# Altium project AirConditioning.PrjPCB
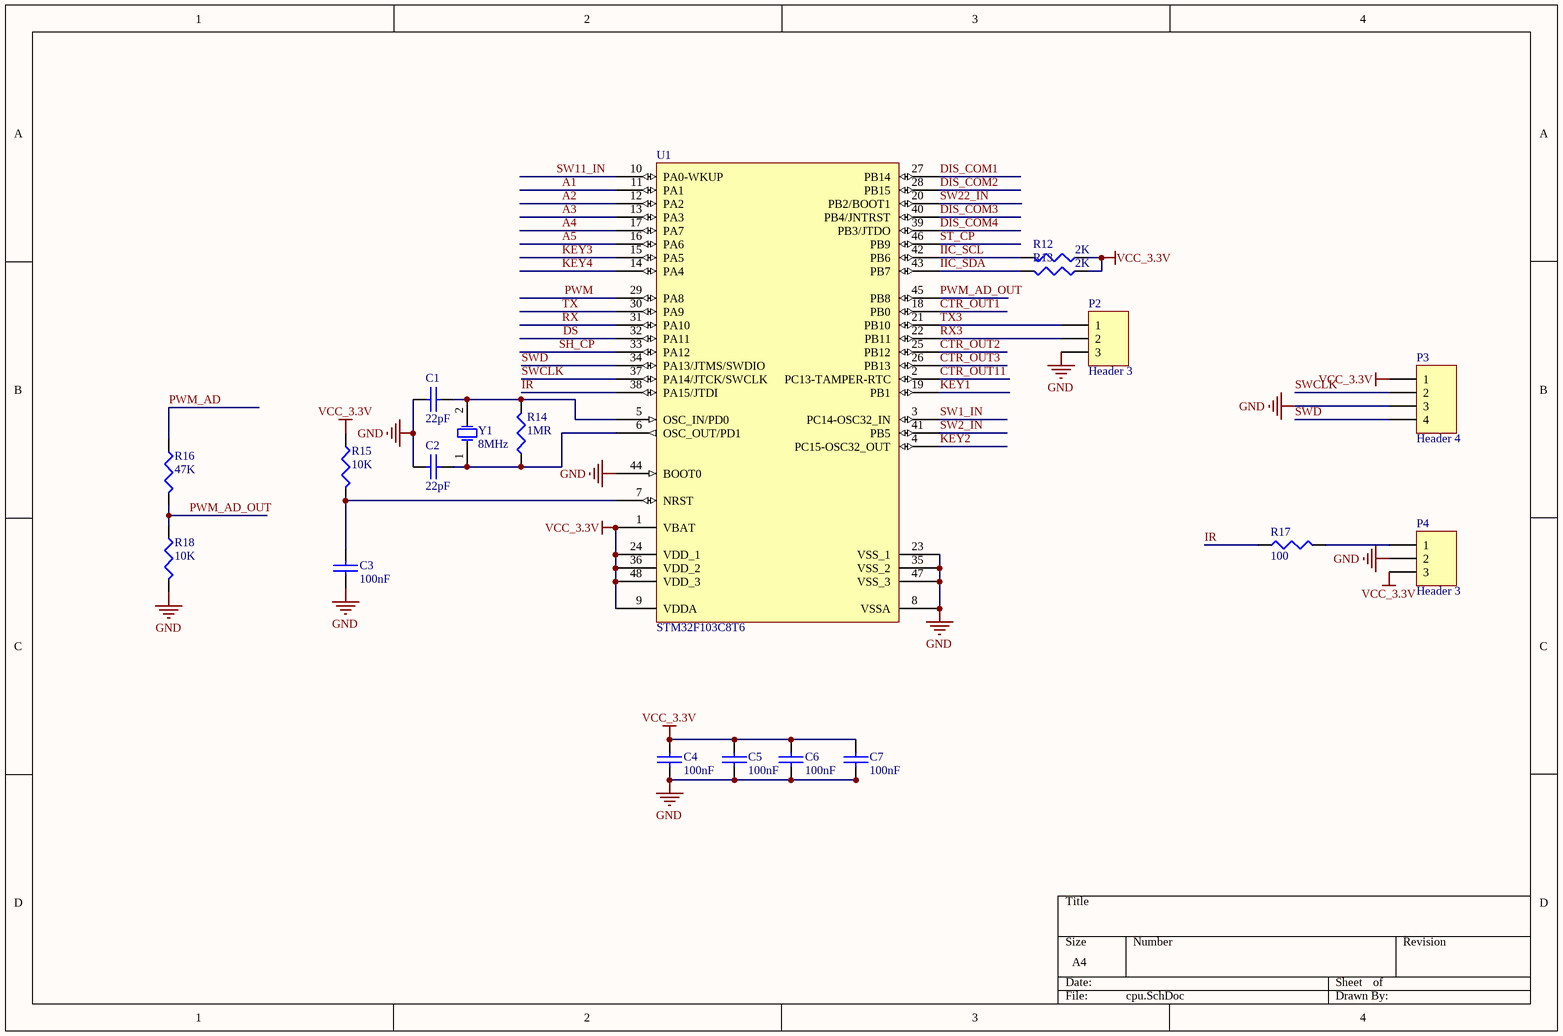
[diagram p0: cpu.SchDoc]
6 sheets, 171 parts. Net scope: global (net labels, ports and power ports of the same name join across sheets).
Board file: PCB1.PcbDoc
Sheets:
  cpu.SchDoc
  POWER.SchDoc
  Connector.SchDoc
  Humidifier.SchDoc
  Display.SchDoc
  POWER2.SchDoc

## Sheet cpu.SchDoc
size A4

### Parts
C1  22pF  [0805c]
C2  22pF  [0805c]
C3  100nF  [0805c]
C4  100nF  [0805c]
C5  100nF  [0805c]
C6  100nF  [0805c]
C7  100nF  [0805c]
P2  Header 3  [HDR1X3]
P3  Header 4  [HDR1X4]
P4  Header 3  [HDR1X3]
R12  2K  [0805R]
R13  2K  [0805R]
R14  1MR  [0805R]
R15  10K  [0805R]
R16  47K  [0805R]
R17  100  [0805R]
R18  10K  [0805R]
U1  STM32F103C8T6  [TQFP-48]
Y1  8MHz  [SMT5032]

### Nets
GND: C1.1 C2.1 C3.1 C4.1 C5.1 C6.1 C7.1 P2.3 P3.3 P4.2 R18.2 U1.8(VSSA) U1.23(VSS_1) U1.35(VSS_2) U1.44(BOOT0) U1.47(VSS_3)
VCC_3.3V: C4.2 C5.2 C6.2 C7.2 P3.1 P4.3 R12.1 R13.1 R15.1 U1.1(VBAT) U1.9(VDDA) U1.24(VDD_1) U1.36(VDD_2) U1.48(VDD_3)
A1: U1.11(PA1)
A2: U1.12(PA2)
A3: U1.13(PA3)
A4: U1.17(PA7)
A5: U1.16(PA6)
CTR_OUT1: U1.18(PB0)
CTR_OUT2: U1.25(PB12)
CTR_OUT3: U1.26(PB13)
CTR_OUT11: U1.2(PC13-TAMPER-RTC)
DIS_COM1: U1.27(PB14)
DIS_COM2: U1.28(PB15)
DIS_COM3: U1.40(PB4/JNTRST)
DIS_COM4: U1.39(PB3/JTDO)
DS: U1.32(PA11)
IIC_SCL: R12.2 U1.42(PB6)
IIC_SDA: R13.2 U1.43(PB7)
IR: R17.1 U1.38(PA15/JTDI)
KEY1: U1.19(PB1)
KEY2: U1.4(PC15-OSC32_OUT)
KEY3: U1.15(PA5)
KEY4: U1.14(PA4)
PWM: U1.29(PA8)
PWM_AD: R16.1
PWM_AD_OUT: R16.2 R18.1 U1.45(PB8)
RX: U1.31(PA10)
RX3: P2.2 U1.22(PB11)
SH_CP: U1.33(PA12)
ST_CP: U1.46(PB9)
SW1_IN: U1.3(PC14-OSC32_IN)
SW2_IN: U1.41(PB5)
SW11_IN: U1.10(PA0-WKUP)
SW22_IN: U1.20(PB2/BOOT1)
SWCLK: P3.2 U1.37(PA14/JTCK/SWCLK)
SWD: P3.4 U1.34(PA13/JTMS/SWDIO)
TX: U1.30(PA9)
TX3: P2.1 U1.21(PB10)
NetC1_2: C1.2 R14.2 U1.5(OSC_IN/PD0) Y1.2(OSC2)
NetC2_2: C2.2 R14.1 U1.6(OSC_OUT/PD1) Y1.1(OSC1)
NetC3_2: C3.2 R15.2 U1.7(NRST)
NetP4_1: P4.1 R17.2

### Library data of the parts
C1-C7 = CAP: Capacitor
P2 P4 = Header 3: Header, 3-Pin; LatestRevisionDate: 17-Jul-2002; LatestRevisionNote: Re-released for DXP Platform.; Publisher: Altium Limited
P3 = Header 4: Header, 4-Pin; LatestRevisionDate: 17-Jul-2002; LatestRevisionNote: Re-released for DXP Platform.; Publisher: Altium Limited
R12-R18 = Res3: Resistor; Published: 8-Jun-2000; LatestRevisionDate: 29-May-2009; LatestRevisionNote: IPC-7351 Footprint Added.; PackageReference: J1-0603; Publisher: Altium Limited; PackageDescription: Chip Resistor
U1 = STM32F103C8T6: STM32 ARM-based 32-bit MCU with 64 Kbytes Flash, 48-pin LQFP, Industrial Temperature; Published: 30-May-2008; DatasheetVersion: rev6, Mar-2008; PackageVersion: Mar-2008; PackageReference: LQFP48; Publisher: Altium Limited; PackageDescription: 48-Pin Low-Profile Quad Flat Pack, 7 x 7 mm Body, 0.5 mm Pitch (LQFP48); ComponentLink1Description: Manufacturer Link; ComponentLink1URL: www.st.com/stm32; ComponentLink2Description: Datasheet; ComponentLink2URL: http://www.st.com/stonline/products/literature/ds/13587.pdf
Y1 = XTAL: Crystal Oscillator; Published: 8-Jun-2000; LatestRevisionDate: 17-Jul-2002; LatestRevisionNote: Re-released for DXP Platform.; PackageReference: R38; Publisher: Altium Limited; PackageDescription: Crystal, Thru-Hole; 2 Leads; Body 3.1 x 8.2 mm (Dia.xH)

## Sheet POWER.SchDoc
size A3
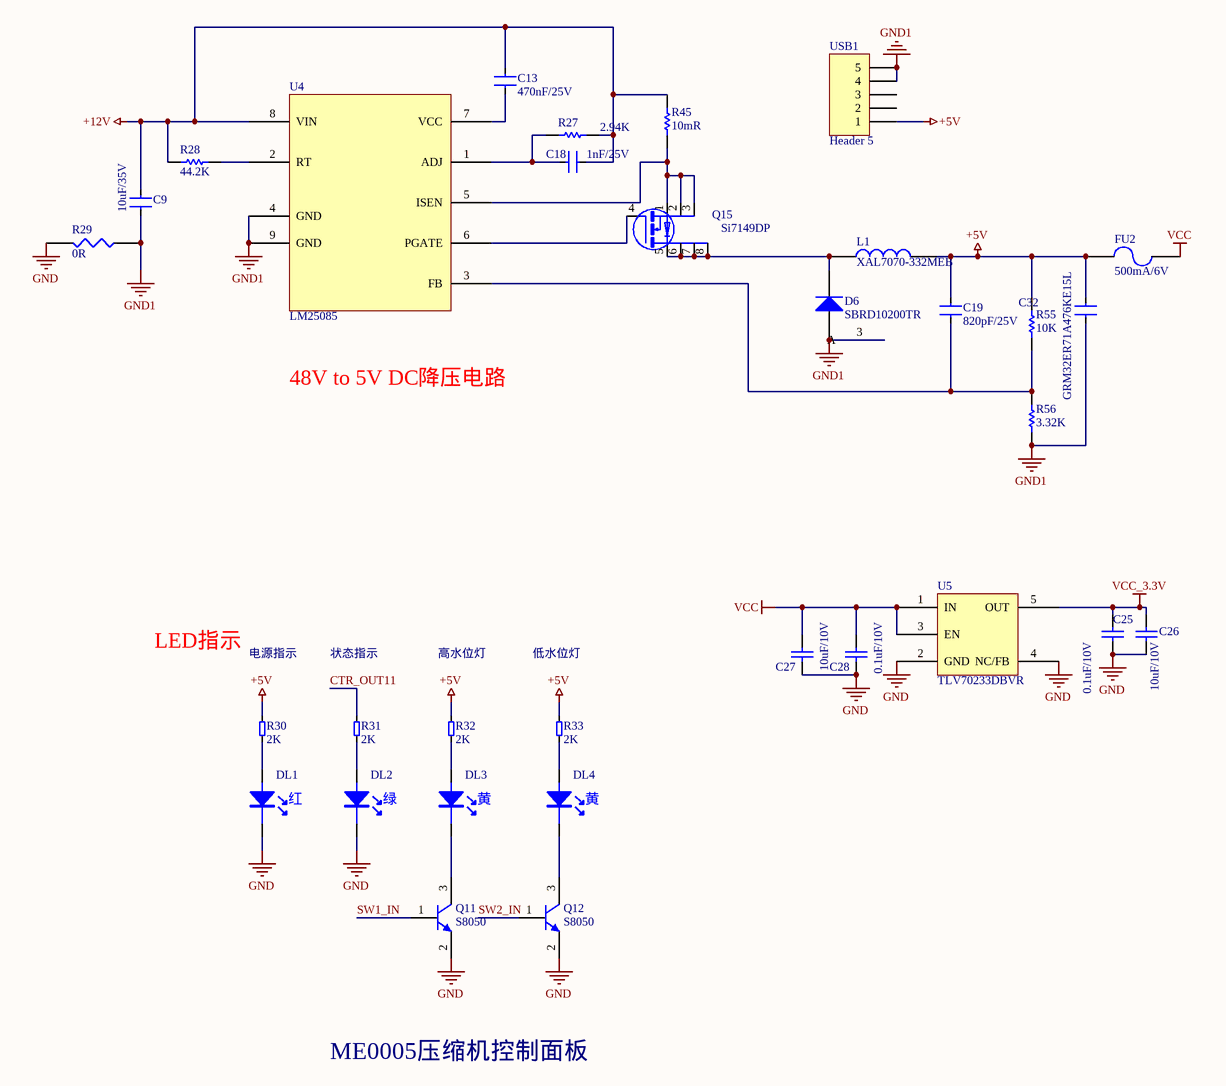
[diagram p1: POWER.SchDoc]

### Parts
C9  10uF/35V  [1210C]
C13  470nF/25V  [0603C]
C18  1nF/25V  [0603C]
C19  820pF/25V  [0603C]
C25  0.1uF/10V  [0603C]
C26  10uF/10V  [0603C]
C27  10uF/10V  [0603C]
C28  0.1uF/10V  [0603C]
C32  GRM32ER71A476KE15L  [1210C]
D6  SBRD10200TR  [TO228P970-3N]
DL1  红  [LED-3]
DL2  绿  [LED-3]
DL3  黄  [LED-3]
DL4  黄  [LED-3]
FU2  500mA/6V  [F0805]
L1  XAL7070-332MEB  [XAL7070]
Q11  S8050  [SOT23-3]
Q12  S8050  [SOT23-3]
Q15  Si7149DP  [PowerPAK SO-8]
R27  2.94K  [0603R]
R28  44.2K  [0603R]
R29  0R  [0805R]
R30  2K  [0805R]
R31  2K  [0805R]
R32  2K  [0805R]
R33  2K  [0805R]
R45  10mR  [1206R]
R55  10K  [0603R]
R56  3.32K  [0603R]
U4  LM25085  [SOP65P490X265_HS-8N]
U5  TLV70233DBVR  [SOT23-5(DBV)]
USB1  Header 5  [USB-A]

### Nets
+5V: C19.1 C32.1 FU2.1 L1.2 R30.2 R32.2 R33.2 R55.1 USB1.1
+12V: C9.1 C13.2 C18.1 R27.1 R28.2 R45.1 U4.8(VIN)
GND: C25.2 C26.1 C27.1 C28.2 DL1.K DL2.K Q11.2(E) Q12.2(E) R29.2 U5.2(GND) U5.4(NC/FB)
GND1: C9.2 C32.2 D6.1(A) D6.3(A) R29.1 R56.2 U4.4(GND) U4.9(GND) USB1.4 USB1.5  [project net AGND1]
VCC: C27.2 C28.1 FU2.2 U5.1(IN) U5.3(EN)
VCC_3.3V: C25.1 C26.2 U5.5(OUT)
CTR_OUT11: R31.2
SW1_IN: Q11.1(B)
SW2_IN: Q12.1(B)
NetC13_1: C13.1 U4.7(VCC)
NetC18_2: C18.2 R27.2 U4.1(ADJ)
NetC19_2: C19.2 R55.2 R56.1 U4.3(FB)
NetD6_2: D6.2(K) L1.1 Q15.5(D) Q15.6(D) Q15.7(D) Q15.8(D)
NetDL1_A: DL1.A R30.1
NetDL2_A: DL2.A R31.1
NetDL3_A: DL3.A R32.1
NetDL3_K: DL3.K Q11.3(C)
NetDL4_A: DL4.A R33.1
NetDL4_K: DL4.K Q12.3(C)
NetQ15_1: Q15.1(S) Q15.2(S) Q15.3(S) R45.2 U4.5(ISEN)
NetQ15_4: Q15.4(G) U4.6(PGATE)
NetR28_1: R28.1 U4.2(RT)

Not connected (* = marked no-connect by the designer): USB1 2 3

### Notes on the sheet
- 48V to 5V DC降压电路
- LED指示
- 电源指示
- 状态指示
- 高水位灯
- 低水位灯
- ME0005压缩机控制面板

### Library data of the parts
C9 C13 C18 C19 C32 = 0.01UF: CCX85-103
C25 C28 = Cap: Capacitor; Value: 104; Published: 8-Jun-2000; LatestRevisionDate: 17-Jul-2002; LatestRevisionNote: Re-released for DXP Platform.; PackageReference: RAD-0.3; Publisher: Altium Limited
C26 = Cap: Capacitor; Published: 8-Jun-2000; LatestRevisionDate: 17-Jul-2002; LatestRevisionNote: Re-released for DXP Platform.; PackageReference: RAD-0.3; Publisher: Altium Limited; Value: 10uF/10V
C27 = Cap: Capacitor; Value: 106/50V; Published: 8-Jun-2000; LatestRevisionDate: 17-Jul-2002; LatestRevisionNote: Re-released for DXP Platform.; PackageReference: RAD-0.3; Publisher: Altium Limited
D6 = Diode_2: Default Diode; Published: 8-Jun-2000; LatestRevisionDate: 17-Jul-2002; LatestRevisionNote: Re-released for DXP Platform.; PackageVersion: Sep-1996; PackageReference: SMC; Publisher: Altium Limited; PackageDescription: DO-214-AB/SMC; 2 C-Bend Leads; Body 7.9 x 5.9 mm, inc. leads (LxW); Code_JEDEC: DO-214-AB
DL1-DL4 = L-7113SRD-D: CP-L-7113SRD-D
FU2 = FUSE2: Fuse
L1 = INDUCTOR
Q11 Q12 = NPN: NPN Bipolar Transistor; Published: 8-Jun-2000; LatestRevisionDate: 17-Jul-2002; LatestRevisionNote: Re-released for DXP Platform.; PackageReference: TO-226; Publisher: Altium Limited; Code_JEDEC: TO-226-AA
Q15 = Si4004DY
R27 R28 R45 R55 R56 = Res Semi: Semiconductor Resistor; Value: 1K; Published: 8-Jun-2000; LatestRevisionDate: 17-Jul-2002; LatestRevisionNote: Re-released for DXP Platform.; PackageReference: AXIAL-0.5; Publisher: Altium Limited
R29 = RES1
R30-R33 = 1K: CR85-102J
U5 = TLV70230DBVR
USB1 = Header 5: Header, 5-Pin; LatestRevisionDate: 17-Jul-2002; LatestRevisionNote: Re-released for DXP Platform.; Publisher: Altium Limited

## Sheet Connector.SchDoc
size A3
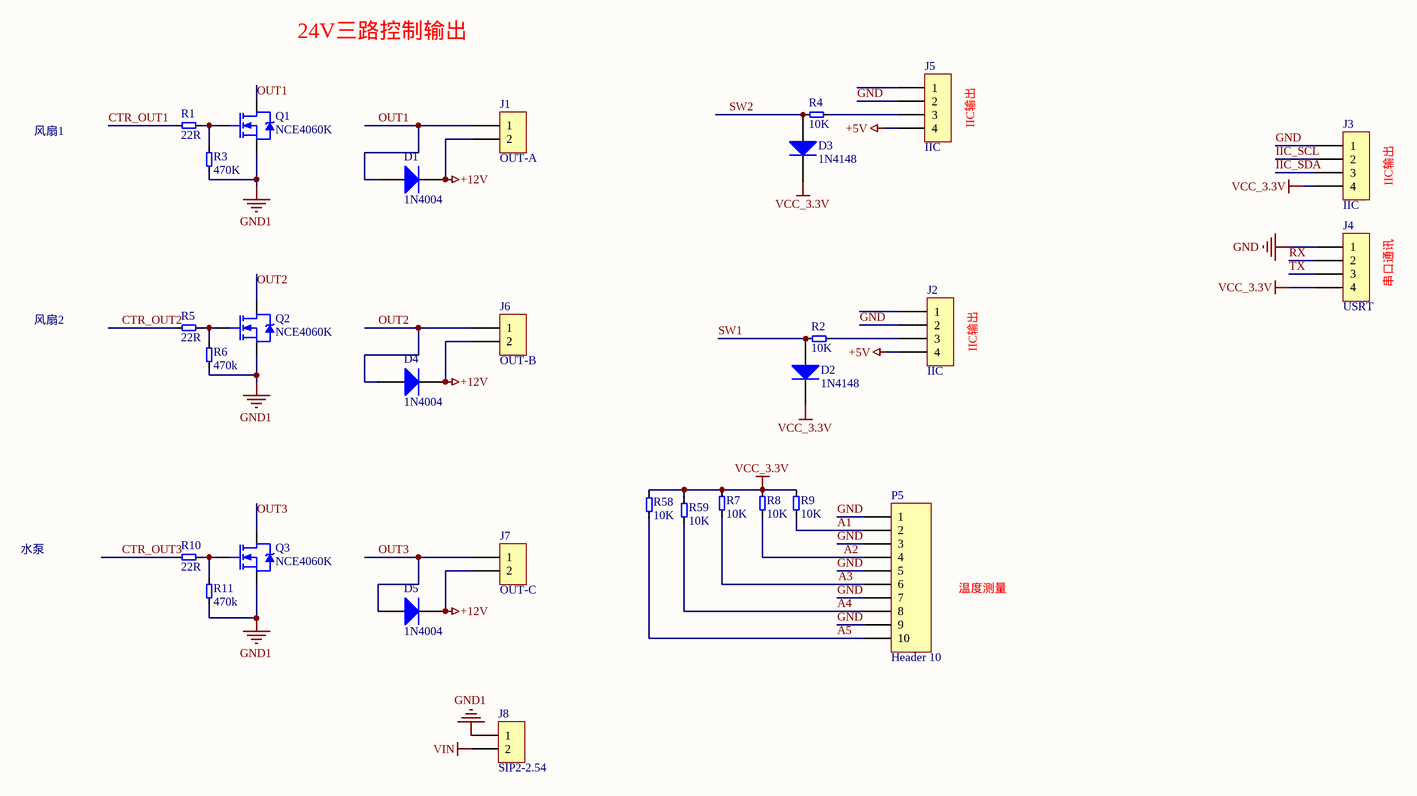
[diagram p2: Connector.SchDoc]

### Parts
D1  1N4004  [D7227]
D2  1N4148  [sod323]
D3  1N4148  [sod323]
D4  1N4004  [D7227]
D5  1N4004  [D7227]
J1  OUT-A  [CH3.96-2P]
J2  IIC  [SIP-4L]
J3  IIC  [SIP-4L]
J4  USRT  [SIP-4L]
J5  IIC  [SIP-4L]
J6  OUT-B  [CH3.96-2P]
J7  OUT-C  [CH3.96-2P]
J8  SIP2-2.54  [CH3.96-2P]
P5  Header 10  [SIP-10L]
Q1  NCE4060K  [TO-252-3S]
Q2  NCE4060K  [TO-252-3S]
Q3  NCE4060K  [TO-252-3S]
R1  22R  [0805R]
R2  10K  [0805R]
R3  470K  [0805R]
R4  10K  [0805R]
R5  22R  [0805R]
R6  470k  [0805R]
R7  10K  [0805R]
R8  10K  [0805R]
R9  10K  [0805R]
R10  22R  [0805R]
R11  470k  [0805R]
R58  10K  [0805R]
R59  10K  [0805R]

### Nets
+5V: J2.4 J5.4
+12V: D1.K D4.K D5.K J1.2 J6.2 J7.2
GND: J2.2 J3.1 J4.1 J5.2 P5.1 P5.3 P5.5 P5.7 P5.9
GND1: J8.1 Q1.3(S) Q2.3(S) Q3.3(S) R3.1 R6.1 R11.1  [project net AGND1]
VCC_3.3V: D2.K D3.K J3.4 J4.4 R7.2 R8.2 R9.2 R58.2 R59.1
VIN: J8.2
A1: P5.2 R9.1
A2: P5.4 R8.1
A3: P5.6 R7.1
A4: P5.8 R59.2
A5: P5.10 R58.1
CTR_OUT1: R1.1
CTR_OUT2: R5.1
CTR_OUT3: R10.1
IIC_SCL: J3.2
IIC_SDA: J3.3
OUT1: D1.A J1.1 Q1.2(D)
OUT2: D4.A J6.1 Q2.2(D)
OUT3: D5.A J7.1 Q3.2(D)
RX: J4.2
SW1: D2.A R2.2
SW2: D3.A R4.2
TX: J4.3
NetJ2_3: J2.3 R2.1
NetJ5_3: J5.3 R4.1
NetQ1_1: Q1.1(G) R1.2 R3.2
NetQ2_1: Q2.1(G) R5.2 R6.2
NetQ3_1: Q3.1(G) R10.2 R11.2

Not connected (* = marked no-connect by the designer): J2 1; J5 1

### Notes on the sheet
- 24V三路控制输出
- 风扇1
- (near J5) IIC输出
- (near J3) IIC输出
- (near J4) 串口通讯
- 风扇2
- (near J2) IIC输出
- 水泵
- 温度测量

### Library data of the parts
D1 D4 D5 = Diode_2: Default Diode; Published: 8-Jun-2000; LatestRevisionDate: 17-Jul-2002; LatestRevisionNote: Re-released for DXP Platform.; PackageVersion: Sep-1996; PackageReference: SMC; Publisher: Altium Limited; PackageDescription: DO-214-AB/SMC; 2 C-Bend Leads; Body 7.9 x 5.9 mm, inc. leads (LxW); Code_JEDEC: DO-214-AB
D2 D3 = Diode: Default Diode; Published: 8-Jun-2000; LatestRevisionDate: 17-Jul-2002; LatestRevisionNote: Re-released for DXP Platform.; PackageVersion: Sep-1996; PackageReference: SMC; Publisher: Altium Limited; Code_JEDEC: DO-214-AB
J1 J6 J7 = CON2: Connector
J2-J5 = SIP4-2.54: CN-SIP4-2.54
J8 = SIP2-2.54: CN-SIP2-2.54
P5 = Header 10: Header, 10-Pin; LatestRevisionDate: 17-Jul-2002; LatestRevisionNote: Re-released for DXP Platform.; Publisher: Altium Limited
Q1-Q3 = NCE4060K: NMOSFET
R1-R11 R58 R59 = 1K: CR85-102J

## Sheet Humidifier.SchDoc
size A3
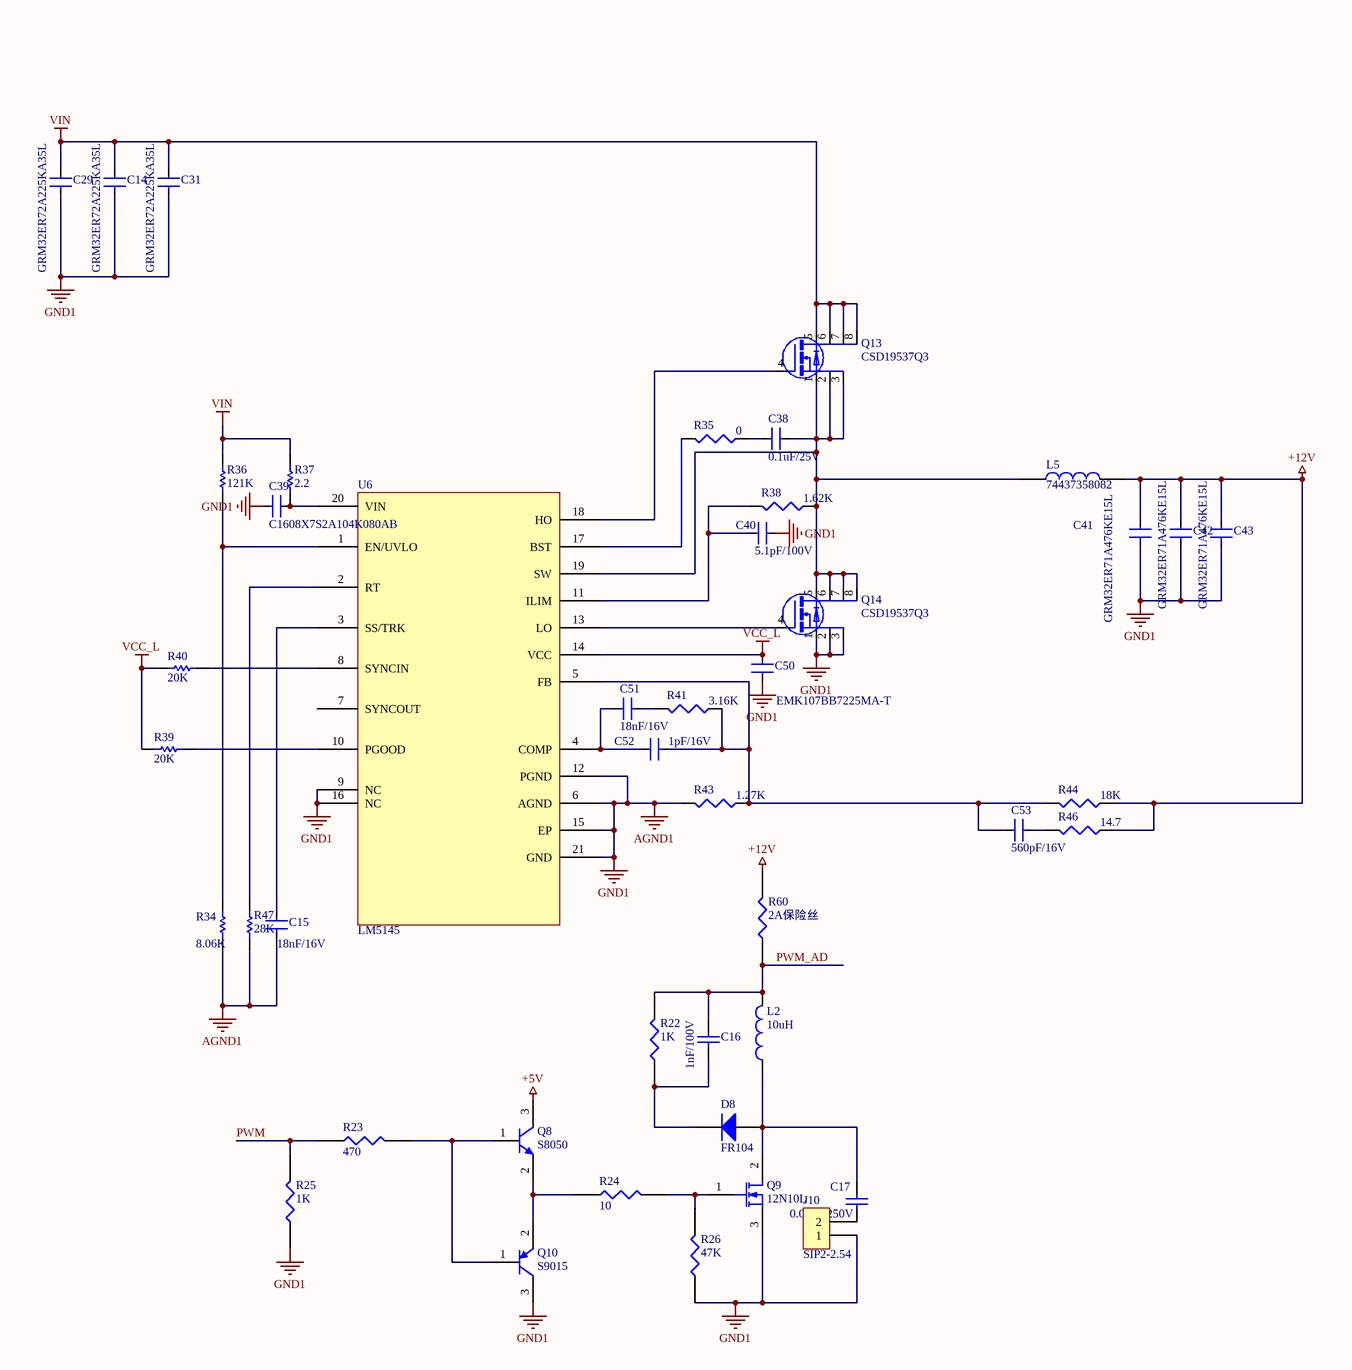
[diagram p3: Humidifier.SchDoc]

### Parts
C14  GRM32ER72A225KA35L  [1210C]
C15  18nF/16V  [0603C]
C16  1nF/100V  [CAP_5MM]
C17  0.047F/250V  [CAP_5MM]
C29  GRM32ER72A225KA35L  [1210C]
C31  GRM32ER72A225KA35L  [1210C]
C38  0.1uF/25V  [0603C]
C39  C1608X7S2A104K080AB  [0603C]
C40  5.1pF/100V  [0603C]
C41  GRM32ER71A476KE15L  [1210C]
C42  GRM32ER71A476KE15L  [1210C]
C43  GRM32ER71A476KE15L  [1210C]
C50  EMK107BB7225MA-T  [0603C]
C51  18nF/16V  [0603C]
C52  1pF/16V  [0603C]
C53  560pF/16V  [0603C]
D8  FR104  [SMA]
J10  SIP2-2.54  [SIP-2L]
L2  10uH  [6*8]
L5  74437358082  [SRP1270-2R2M]
Q8  S8050  [SOT23-3]
Q9  12N10L  [TO230P973X238-3N]
Q10  S9015  [SOT23-3]
Q13  CSD19537Q3  [PowerPAK SO-8]
Q14  CSD19537Q3  [PowerPAK SO-8]
R22  1K  [0805R]
R23  470  [0805R]
R24  10  [0805R]
R25  1K  [0805R]
R26  47K  [0805R]
R34  8.06K  [0603R]
R35  0  [0603R]
R36  121K  [0805R]
R37  2.2  [0603R]
R38  1.62K  [0603R]
R39  20K  [0603R]
R40  20K  [0603R]
R41  3.16K  [0603R]
R43  1.27K  [0603R]
R44  18K  [0603R]
R46  14.7  [0603R]
R47  28K  [0603R]
R60  2A保险丝  [0805R]
U6  LM5145  [QFN050P600-8N]

### Nets
+5V: Q8.3(C)
+12V: C41.1 C42.1 C43.1 L5.2 R44.1 R46.1 R60.2
AGND1: C14.2 C15.2 C29.2 C31.2 C39.1 C40.1 C41.2 C42.2 C43.2 C50.2 J10.1 Q9.3(S) Q10.3(C) Q14.1(S) Q14.2(S) Q14.3(S) R25.1 R26.1 R34.1 R43.2 R47.1 U6.6(AGND) U6.9(NC) U6.12(PGND) U6.15(EP) U6.16(NC) U6.21(GND)  [also labelled GND1]
VCC_L: C50.1 R39.2 R40.2 U6.14(VCC)
VIN: C14.1 C29.1 C31.1 Q13.5(D) Q13.6(D) Q13.7(D) Q13.8(D) R36.2 R37.1
PWM: R23.1 R25.2
PWM_AD: C16.2 L2.2 R22.2 R60.1
NetC15_1: C15.1 U6.3(SS/TRK)
NetC16_1: C16.1 D8.2(K) R22.1
NetC17_1: C17.1 J10.2
NetC17_2: C17.2 D8.1(A) L2.1 Q9.2(D)
NetC38_1: C38.1 R35.1
NetC38_2: C38.2 L5.1 Q13.1(S) Q13.2(S) Q13.3(S) Q14.5(D) Q14.6(D) Q14.7(D) Q14.8(D) R38.1 U6.19(SW)
NetC39_2: C39.2 R37.2 U6.20(VIN)
NetC40_2: C40.2 R38.2 U6.11(ILIM)
NetC51_1: C51.1 C52.1 U6.4(COMP)
NetC51_2: C51.2 R41.2
NetC52_2: C52.2 C53.1 R41.1 R43.1 R44.2 U6.5(FB)
NetC53_2: C53.2 R46.2
NetQ8_1: Q8.1(B) Q10.1(B) R23.2
NetQ8_2: Q8.2(E) Q10.2(E) R24.1
NetQ9_1: Q9.1(G) R24.2 R26.2
NetQ13_4: Q13.4(G) U6.18(HO)
NetQ14_4: Q14.4(G) U6.13(LO)
NetR34_2: R34.2 R36.1 U6.1(EN/UVLO)
NetR35_2: R35.2 U6.17(BST)
NetR39_1: R39.1 U6.10(PGOOD)
NetR40_1: R40.1 U6.8(SYNCIN)
NetR47_2: R47.2 U6.2(RT)

Not connected (* = marked no-connect by the designer): U6 7(SYNCOUT)

### Library data of the parts
C14 C15 C29 C31 C38-C43 C50-C53 = 0.01UF: CCX85-103
C16 = Cap: Capacitor; Published: 8-Jun-2000; LatestRevisionDate: 17-Jul-2002; LatestRevisionNote: Re-released for DXP Platform.; PackageReference: RAD-0.3; Publisher: Altium Limited; Value: 1nF/100V
C17 = Cap: Capacitor; Value: 1nF/100V; Published: 8-Jun-2000; LatestRevisionDate: 17-Jul-2002; LatestRevisionNote: Re-released for DXP Platform.; PackageReference: RAD-0.3; Publisher: Altium Limited
D8 = Diode_2: Default Diode; Published: 8-Jun-2000; LatestRevisionDate: 17-Jul-2002; LatestRevisionNote: Re-released for DXP Platform.; PackageVersion: Sep-1996; PackageReference: SMC; Publisher: Altium Limited; PackageDescription: DO-214-AB/SMC; 2 C-Bend Leads; Body 7.9 x 5.9 mm, inc. leads (LxW); Code_JEDEC: DO-214-AB
J10 = SIP2-2.54: CN-SIP2-2.54
L2 = Inductor: Code_IEC: 1005; Published: 8-Jun-2000; LatestRevisionDate: 29-May-2009; LatestRevisionNote: IPC-7351 Footprint Added.; PackageReference: 0402-A; Publisher: Altium Limited; PackageDescription: Chip Inductor; Code_JEITA: 0402; Value: 10uH
L5 = INDUCTOR
Q8 = NPN: NPN Bipolar Transistor; Published: 8-Jun-2000; LatestRevisionDate: 17-Jul-2002; LatestRevisionNote: Re-released for DXP Platform.; PackageReference: TO-226; Publisher: Altium Limited; Code_JEDEC: TO-226-AA
Q9 = MOSFET-N: N-Channel MOSFET; Published: 8-Jun-2000; LatestRevisionDate: 17-Jul-2002; LatestRevisionNote: Re-released for DXP Platform.; PackageVersion: 1995/1996; PackageReference: E3; Publisher: Altium Limited
Q10 = PNP: PNP Bipolar Transistor; Published: 8-Jun-2000; LatestRevisionDate: 29-May-2009; LatestRevisionNote: IPC-7351 Footprint Added.; PackageVersion: Aug-1999; PackageReference: SOT-23B; Publisher: Altium Limited; PackageDescription: 3-Pin SOT-23 Package 0.95 mm Pitch, 2.4 mm Lead Span
Q13 Q14 = Si4004DY
R22-R26 R60 = RES1
R34 R36 R37 R39 R40 R47 = Res Semi: Semiconductor Resistor; Value: 1K; Published: 8-Jun-2000; LatestRevisionDate: 17-Jul-2002; LatestRevisionNote: Re-released for DXP Platform.; PackageReference: AXIAL-0.5; Publisher: Altium Limited
R35 R38 R41 R43 R44 R46 = Res3: Resistor; Published: 8-Jun-2000; LatestRevisionDate: 29-May-2009; LatestRevisionNote: IPC-7351 Footprint Added.; PackageReference: J1-0603; Publisher: Altium Limited; PackageDescription: Chip Resistor

## Sheet Display.SchDoc
size A4
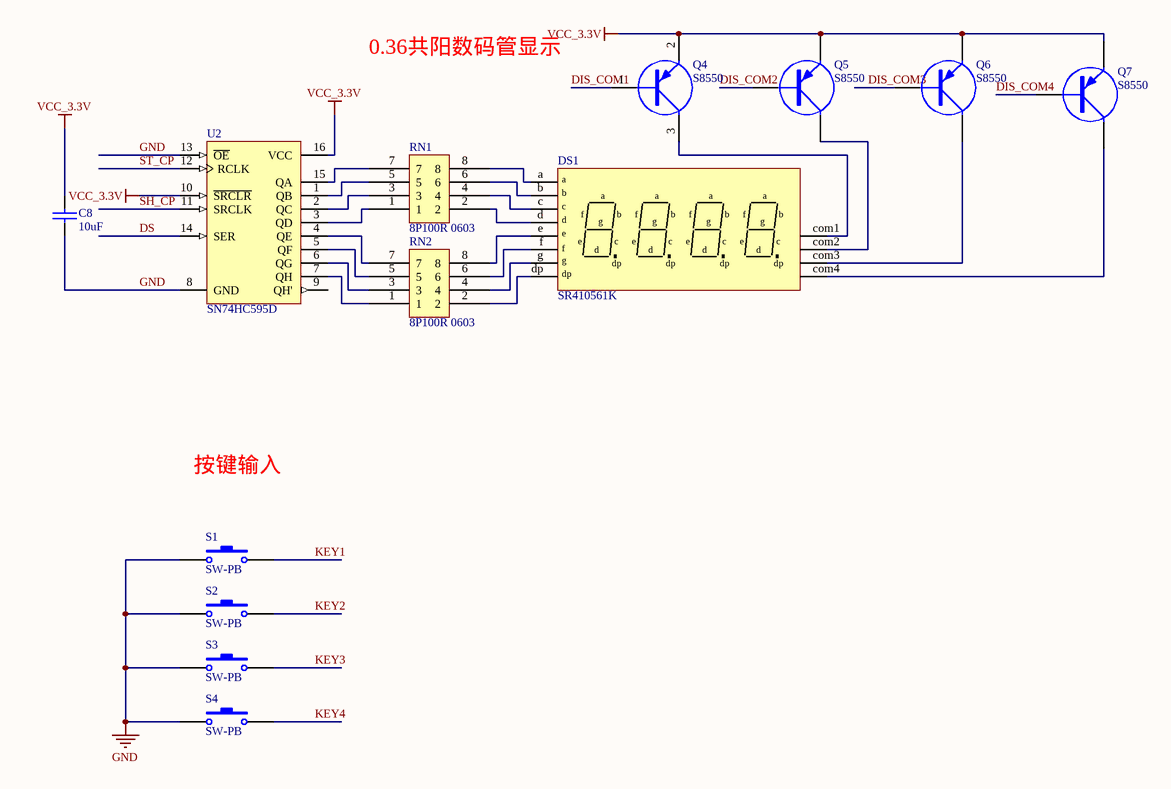
[diagram p4: Display.SchDoc]

### Parts
C8  10uF  [0805c]
DS1  SR410561K  [SR410361]
Q4  S8550  [SOT-23_B]
Q5  S8550  [SOT-23_B]
Q6  S8550  [SOT-23_B]
Q7  S8550  [SOT-23_B]
RN1  8P100R 0603  [8P4R_0603]
RN2  8P100R 0603  [8P4R_0603]
S1  SW-PB  [BUTTON_SMT_6*6]
S2  SW-PB  [BUTTON_SMT_6*6]
S3  SW-PB  [BUTTON_SMT_6*6]
S4  SW-PB  [BUTTON_SMT_6*6]
U2  SN74HC595D  [SO-16N]

### Nets
GND: C8.1 S1.1 S2.1 S3.1 S4.1 U2.8(GND) U2.13(~{OE})
VCC_3.3V: C8.2 Q4.2(E) Q5.2(E) Q6.2(E) Q7.2(E) U2.10(~{SRCLR}) U2.16(VCC)
DIS_COM1: Q4.1(B)
DIS_COM2: Q5.1(B)
DIS_COM3: Q6.1(B)
DIS_COM4: Q7.1(B)
DS: U2.14(SER)
KEY1: S1.2
KEY2: S2.2
KEY3: S3.2
KEY4: S4.2
SH_CP: U2.11(SRCLK)
ST_CP: U2.12(RCLK)
NetDS1_a: DS1.a RN1.8
NetDS1_b: DS1.b RN1.6
NetDS1_c: DS1.c RN1.4
NetDS1_com1: DS1.com1 Q4.3(C)
NetDS1_com2: DS1.com2 Q5.3(C)
NetDS1_com3: DS1.com3 Q6.3(C)
NetDS1_com4: DS1.com4 Q7.3(C)
NetDS1_d: DS1.d RN1.2
NetDS1_dp: DS1.dp RN2.2
NetDS1_e: DS1.e RN2.8
NetDS1_f: DS1.f RN2.6
NetDS1_g: DS1.g RN2.4
NetRN1_1: RN1.1 U2.3(QD)
NetRN1_3: RN1.3 U2.2(QC)
NetRN1_5: RN1.5 U2.1(QB)
NetRN1_7: RN1.7 U2.15(QA)
NetRN2_1: RN2.1 U2.7(QH)
NetRN2_3: RN2.3 U2.6(QG)
NetRN2_5: RN2.5 U2.5(QF)
NetRN2_7: RN2.7 U2.4(QE)

Not connected (* = marked no-connect by the designer): U2 9(QH')

### Notes on the sheet
- 0.36共阳数码管显示
- 按键输入

### Library data of the parts
C8 = CAP: Capacitor
DS1 = SR410561K: CP-SR410561K
Q4-Q7 = PNP: PNP Transistor
RN1 RN2 = 8P4R 0603
S1-S4 = SW-PB: Switch; Published: 24-Mar-1999; LatestRevisionDate: 17-Jul-2002; LatestRevisionNote: Re-released for DXP Platform.; PackageReference: SPST-2; Publisher: Altium Limited
U2 = SN74HC595D: 8-Bit Shift Register with 3-State Output Registers; Published: 8-Jun-2000; LatestRevisionDate: 13-Apr-2006; LatestRevisionNote: IPC-7351 Footprint Added.; DatasheetVersion: May-1997; PackageVersion: Jan-1998; PackageReference: D016; Publisher: Altium Limited; PackageDescription: 16-Pin Small Outline Integrated Circuit 1.27 mm Pitch; Code_IPC: SOIC127P600-16; ComponentLink1Description: Manufacturer Link; ComponentLink1URL: http://www.ti.com/; ComponentLink2Description: Datasheet; ComponentLink2URL: http://www-s.ti.com/sc/ds/sn74hc595.pdf

## Sheet POWER2.SchDoc
size A3
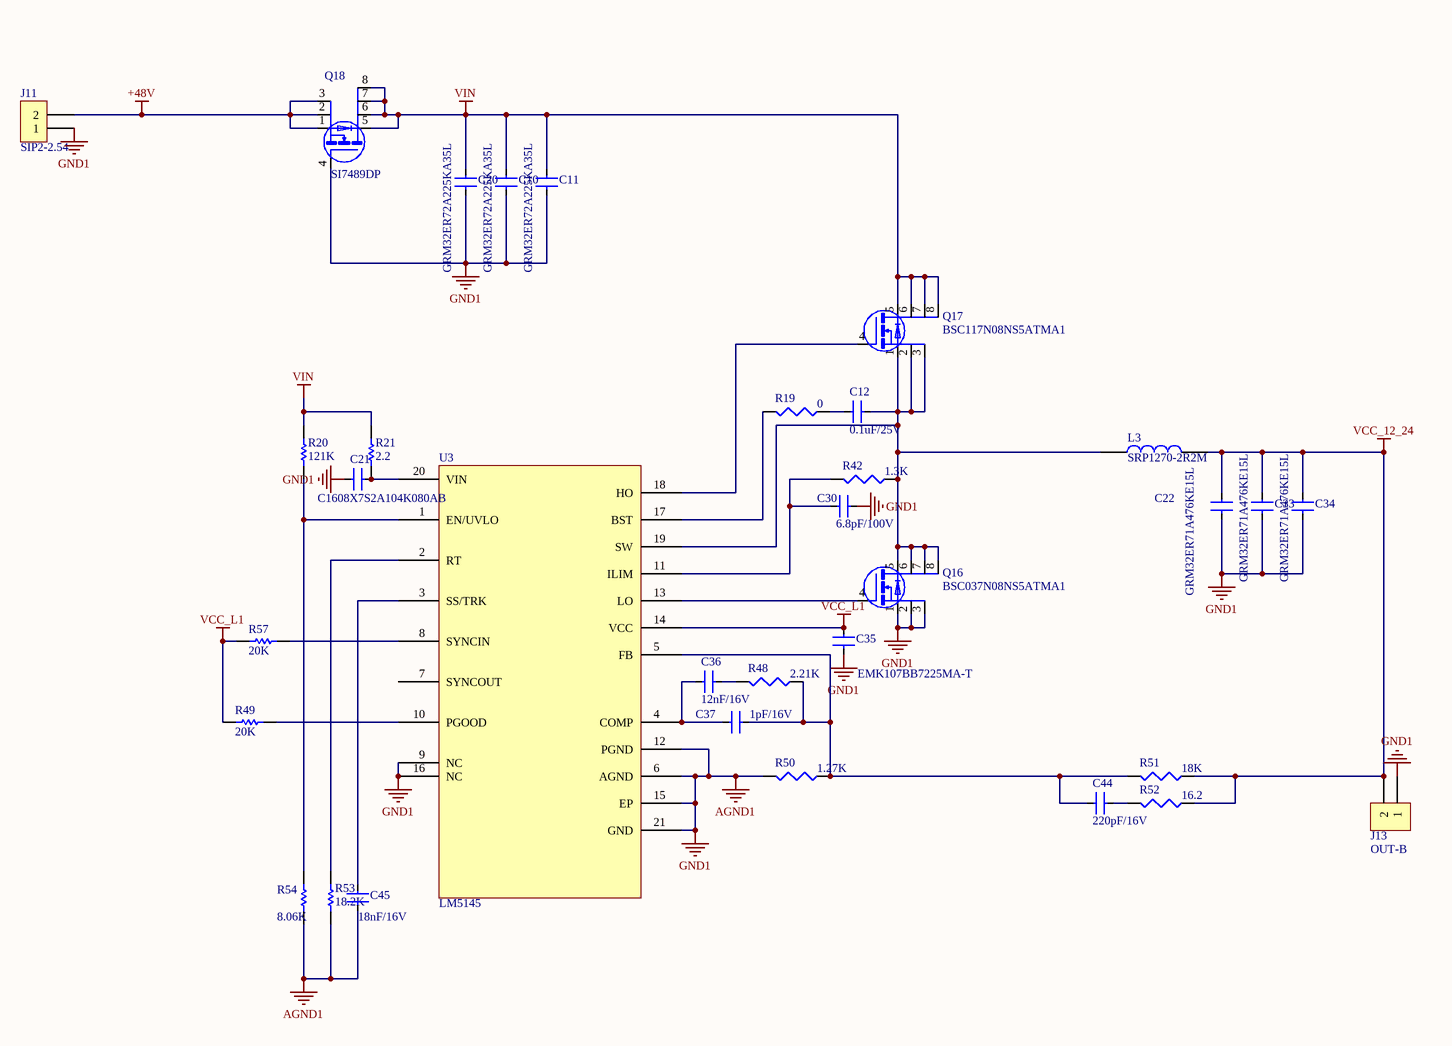
[diagram p5: POWER2.SchDoc]

### Parts
C10  GRM32ER72A225KA35L  [1210C]
C11  GRM32ER72A225KA35L  [1210C]
C12  0.1uF/25V  [0603C]
C20  GRM32ER72A225KA35L  [1210C]
C21  C1608X7S2A104K080AB  [0603C]
C22  GRM32ER71A476KE15L  [1210C]
C30  6.8pF/100V  [0603C]
C33  GRM32ER71A476KE15L  [1210C]
C34  GRM32ER71A476KE15L  [1210C]
C35  EMK107BB7225MA-T  [0603C]
C36  12nF/16V  [0603C]
C37  1pF/16V  [0603C]
C44  220pF/16V  [0603C]
C45  18nF/16V  [0603C]
J11  SIP2-2.54  [CH3.96-2P]
J13  OUT-B  [CH3.96-2P]
L3  SRP1270-2R2M  [SRP1270-2R2M]
Q16  BSC037N08NS5ATMA1  [PowerPAK SO-8]
Q17  BSC117N08NS5ATMA1  [PowerPAK SO-8]
Q18  SI7489DP  [PowerPAK SO-8]
R19  0  [0603R]
R20  121K  [0805R]
R21  2.2  [0603R]
R42  1.3K  [0603R]
R48  2.21K  [0603R]
R49  20K  [0603R]
R50  1.27K  [0603R]
R51  18K  [0603R]
R52  16.2  [0603R]
R53  18.2K  [0603R]
R54  8.06K  [0603R]
R57  20K  [0603R]
U3  LM5145  [QFN050P600-8N]

### Nets
+48V: J11.2 Q18.1(S) Q18.2(S) Q18.3(S)
AGND1: C10.2 C11.2 C20.2 C21.1 C22.2 C30.1 C33.2 C34.2 C35.2 C45.2 J11.1 J13.1 Q16.1(S) Q16.2(S) Q16.3(S) Q18.4(G) R50.2 R53.1 R54.1 U3.6(AGND) U3.9(NC) U3.12(PGND) U3.15(EP) U3.16(NC) U3.21(GND)  [also labelled GND1]
VCC_12_24: C22.1 C33.1 C34.1 J13.2 L3.2 R51.1 R52.1
VCC_L1: C35.1 R49.2 R57.2 U3.14(VCC)
VIN: C10.1 C11.1 C20.1 Q17.5(D) Q17.6(D) Q17.7(D) Q17.8(D) Q18.5(D) Q18.6(D) Q18.7(D) Q18.8(D) R20.2 R21.1
NetC12_1: C12.1 R19.1
NetC12_2: C12.2 L3.1 Q16.5(D) Q16.6(D) Q16.7(D) Q16.8(D) Q17.1(S) Q17.2(S) Q17.3(S) R42.1 U3.19(SW)
NetC21_2: C21.2 R21.2 U3.20(VIN)
NetC30_2: C30.2 R42.2 U3.11(ILIM)
NetC36_1: C36.1 C37.1 U3.4(COMP)
NetC36_2: C36.2 R48.2
NetC37_2: C37.2 C44.1 R48.1 R50.1 R51.2 U3.5(FB)
NetC44_2: C44.2 R52.2
NetC45_1: C45.1 U3.3(SS/TRK)
NetQ16_4: Q16.4(G) U3.13(LO)
NetQ17_4: Q17.4(G) U3.18(HO)
NetR19_2: R19.2 U3.17(BST)
NetR20_1: R20.1 R54.2 U3.1(EN/UVLO)
NetR49_1: R49.1 U3.10(PGOOD)
NetR53_2: R53.2 U3.2(RT)
NetR57_1: R57.1 U3.8(SYNCIN)

Not connected (* = marked no-connect by the designer): U3 7(SYNCOUT)

### Library data of the parts
C10-C12 C20-C22 C30 C33-C37 C44 C45 = 0.01UF: CCX85-103
J11 = SIP2-2.54: CN-SIP2-2.54
J13 = CON2: Connector
L3 = INDUCTOR
Q16-Q18 = Si4004DY
R19 R42 R48 R50-R52 = Res3: Resistor; Published: 8-Jun-2000; LatestRevisionDate: 29-May-2009; LatestRevisionNote: IPC-7351 Footprint Added.; PackageReference: J1-0603; Publisher: Altium Limited; PackageDescription: Chip Resistor
R20 R21 R49 R53 R54 R57 = Res Semi: Semiconductor Resistor; Value: 1K; Published: 8-Jun-2000; LatestRevisionDate: 17-Jul-2002; LatestRevisionNote: Re-released for DXP Platform.; PackageReference: AXIAL-0.5; Publisher: Altium Limited

## Nets that join several sheets
+5V: POWER (9 pins), Connector (J2.4 J5.4), Humidifier (Q8.3)
+12V: POWER (7 pins), Connector (6 pins), Humidifier (7 pins)
AGND1: POWER (10 pins), Connector (7 pins), Humidifier (27 pins), POWER2 (25 pins)
GND: cpu (16 pins), POWER (11 pins), Connector (9 pins), Display (7 pins)
VCC_3.3V: cpu (14 pins), POWER (C25.1 C26.2 U5.5), Connector (9 pins), Display (7 pins)
VIN: Connector (J8.2), Humidifier (9 pins), POWER2 (13 pins)
A1: cpu (U1.11), Connector (P5.2 R9.1)
A2: cpu (U1.12), Connector (P5.4 R8.1)
A3: cpu (U1.13), Connector (P5.6 R7.1)
A4: cpu (U1.17), Connector (P5.8 R59.2)
A5: cpu (U1.16), Connector (P5.10 R58.1)
CTR_OUT1: cpu (U1.18), Connector (R1.1)
CTR_OUT2: cpu (U1.25), Connector (R5.1)
CTR_OUT3: cpu (U1.26), Connector (R10.1)
CTR_OUT11: cpu (U1.2), POWER (R31.2)
DIS_COM1: cpu (U1.27), Display (Q4.1)
DIS_COM2: cpu (U1.28), Display (Q5.1)
DIS_COM3: cpu (U1.40), Display (Q6.1)
DIS_COM4: cpu (U1.39), Display (Q7.1)
DS: cpu (U1.32), Display (U2.14)
IIC_SCL: cpu (R12.2 U1.42), Connector (J3.2)
IIC_SDA: cpu (R13.2 U1.43), Connector (J3.3)
KEY1: cpu (U1.19), Display (S1.2)
KEY2: cpu (U1.4), Display (S2.2)
KEY3: cpu (U1.15), Display (S3.2)
KEY4: cpu (U1.14), Display (S4.2)
PWM: cpu (U1.29), Humidifier (R23.1 R25.2)
PWM_AD: cpu (R16.1), Humidifier (C16.2 L2.2 R22.2 R60.1)
RX: cpu (U1.31), Connector (J4.2)
SH_CP: cpu (U1.33), Display (U2.11)
ST_CP: cpu (U1.46), Display (U2.12)
SW1_IN: cpu (U1.3), POWER (Q11.1)
SW2_IN: cpu (U1.41), POWER (Q12.1)
TX: cpu (U1.30), Connector (J4.3)